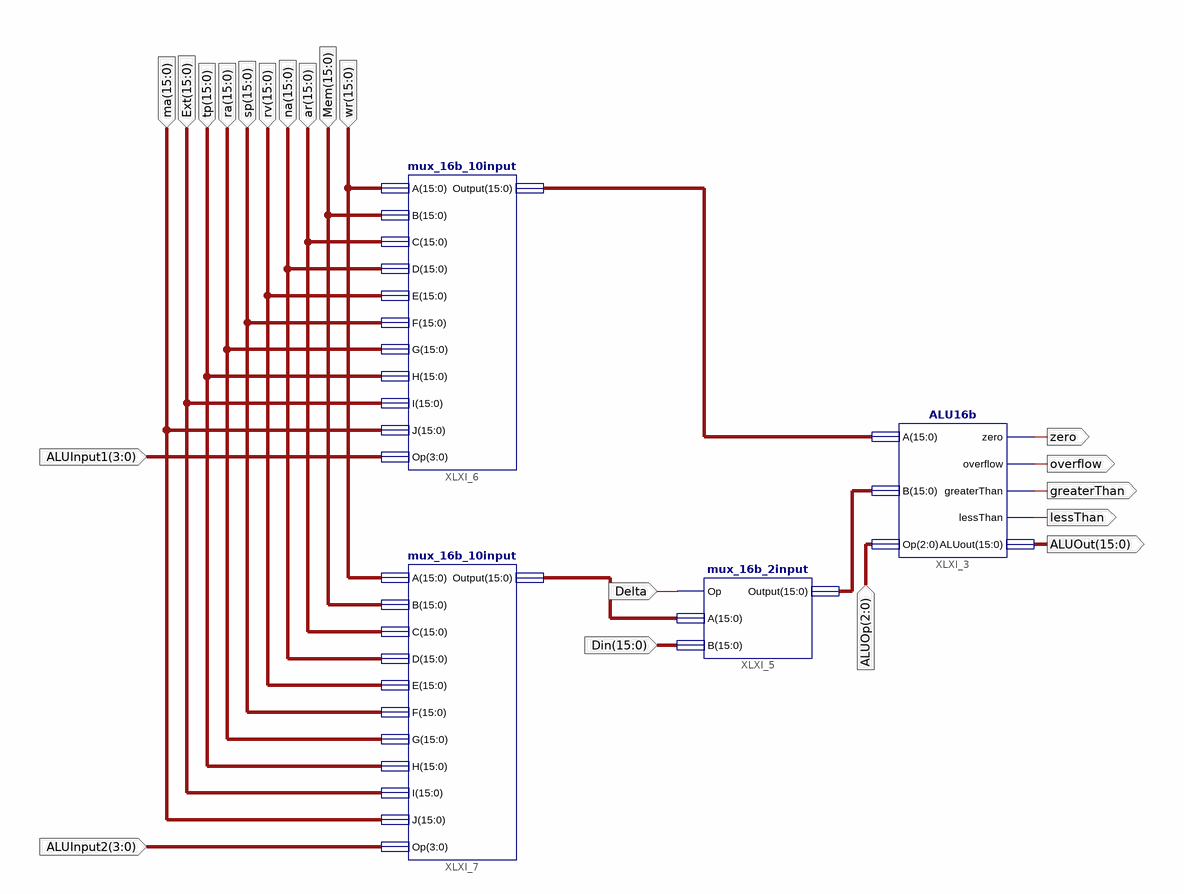
[diagram p0: schematic sheet 1]
// Xilinx ISE schematic integrationPhase3.sch (spartan3e) as structural Verilog: 4 symbols, 20 ports
module integrationPhase3 (
  input  [15:0] wr,
  input  [15:0] Mem,
  input  [15:0] na,
  input  [15:0] ar,
  input  [15:0] rv,
  input  [15:0] sp,
  input  [15:0] ra,
  input  [15:0] tp,
  input  [15:0] Ext,
  input  [15:0] ma,
  input  [3:0] ALUInput2,
  input  [3:0] ALUInput1,
  input  Delta,
  input  [15:0] Din,
  input  [2:0] ALUOp,
  output [15:0] ALUOut,
  output zero,
  output overflow,
  output greaterThan,
  output lessThan
);

  wire [15:0] XLXN_21, XLXN_22, XLXN_23;

  ALU16b XLXI_3 (
    .A(XLXN_21), .B(XLXN_22), .Op(ALUOp), .zero(zero), .overflow(overflow), .greaterThan(greaterThan),
    .lessThan(lessThan), .ALUout(ALUOut));
  mux_16b_2input XLXI_5 (.Op(Delta), .A(XLXN_23), .B(Din), .Output(XLXN_22));
  mux_16b_10input XLXI_6 (
    .A(wr), .B(Mem), .C(ar), .D(na), .E(rv), .F(sp), .G(ra), .H(tp), .I(Ext), .J(ma), .Op(ALUInput1),
    .Output(XLXN_21));
  mux_16b_10input XLXI_7 (
    .A(wr), .B(Mem), .C(ar), .D(na), .E(rv), .F(sp), .G(ra), .H(tp), .I(Ext), .J(ma), .Op(ALUInput2),
    .Output(XLXN_23));
endmodule
